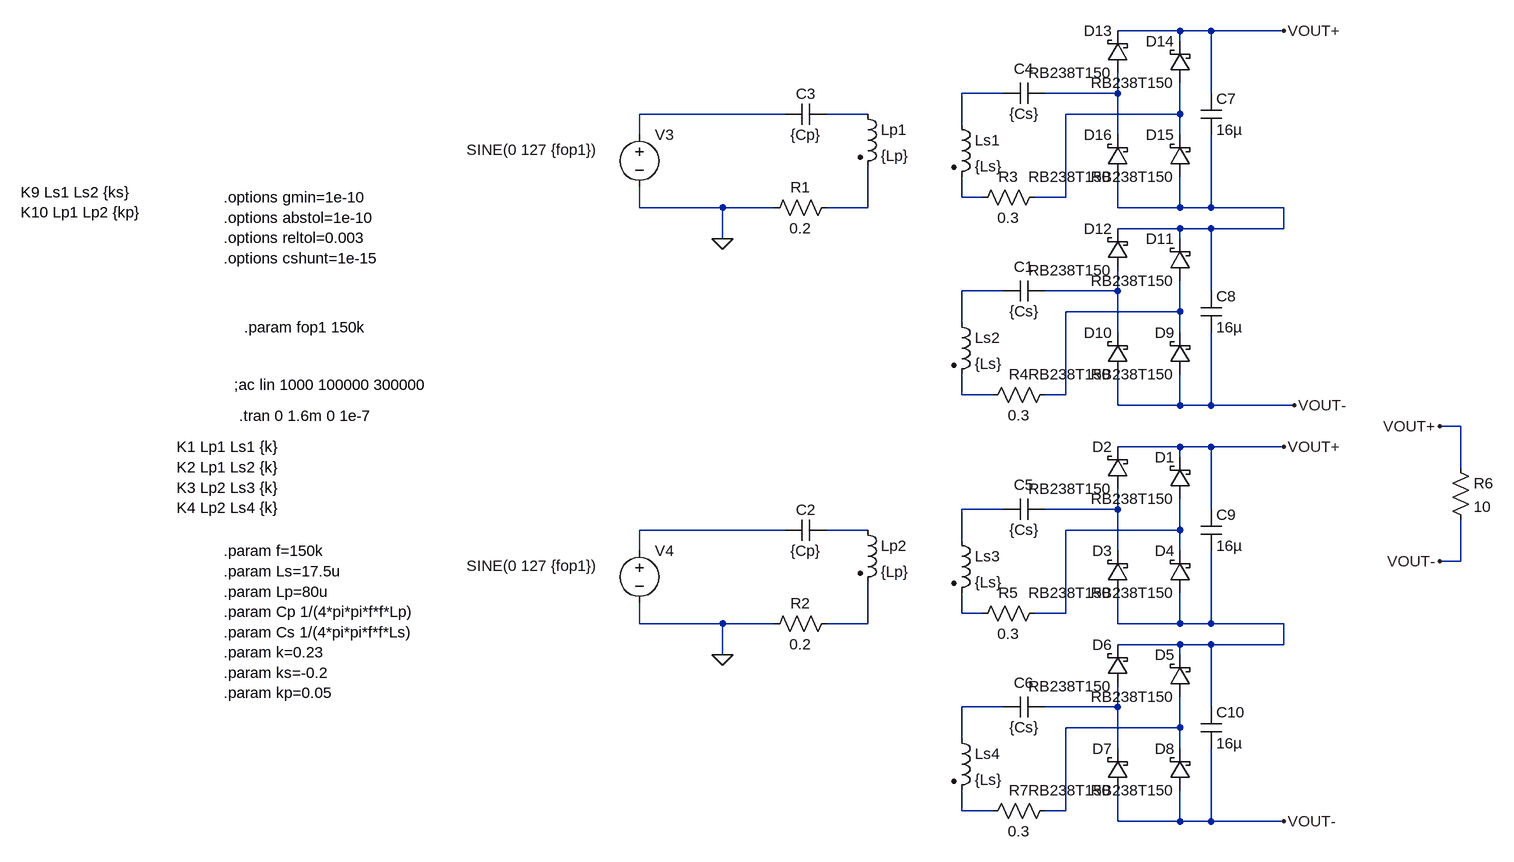
[diagram p0: schematic 2p-4s-series.asc]
2p-4s-series.asc, the LTspice schematic file:
Version 4
SHEET 1 3864 3572
WIRE 1680 512 1584 512
WIRE 1728 512 1680 512
WIRE 1840 512 1728 512
WIRE 1680 528 1680 512
WIRE 1408 608 1344 608
WIRE 1584 608 1584 576
WIRE 1584 608 1472 608
WIRE 1728 608 1728 512
WIRE 1072 640 848 640
WIRE 1200 640 1136 640
WIRE 1680 640 1680 592
WIRE 1680 640 1504 640
WIRE 1344 656 1344 608
WIRE 848 672 848 640
WIRE 1584 672 1584 608
WIRE 1680 672 1680 640
WIRE 1344 768 1344 736
WIRE 1376 768 1344 768
WIRE 1504 768 1504 640
WIRE 1504 768 1456 768
WIRE 848 784 848 752
WIRE 976 784 848 784
WIRE 1056 784 976 784
WIRE 1200 784 1200 720
WIRE 1200 784 1136 784
WIRE 1584 784 1584 736
WIRE 1680 784 1680 736
WIRE 1680 784 1584 784
WIRE 1728 784 1728 672
WIRE 1728 784 1680 784
WIRE 1840 784 1728 784
WIRE 1680 816 1584 816
WIRE 1728 816 1680 816
WIRE 1840 816 1840 784
WIRE 1840 816 1728 816
WIRE 976 832 976 784
WIRE 1680 832 1680 816
WIRE 1408 912 1344 912
WIRE 1584 912 1584 880
WIRE 1584 912 1472 912
WIRE 1728 912 1728 816
WIRE 1680 944 1680 896
WIRE 1680 944 1504 944
WIRE 1344 960 1344 912
WIRE 1584 976 1584 912
WIRE 1680 976 1680 944
WIRE 1344 1072 1344 1040
WIRE 1392 1072 1344 1072
WIRE 1504 1072 1504 944
WIRE 1504 1072 1472 1072
WIRE 1584 1088 1584 1040
WIRE 1680 1088 1680 1040
WIRE 1680 1088 1584 1088
WIRE 1728 1088 1728 976
WIRE 1728 1088 1680 1088
WIRE 1856 1088 1728 1088
WIRE 2112 1120 2080 1120
WIRE 1680 1152 1584 1152
WIRE 1728 1152 1680 1152
WIRE 1840 1152 1728 1152
WIRE 1680 1168 1680 1152
WIRE 2112 1184 2112 1120
WIRE 1408 1248 1344 1248
WIRE 1584 1248 1584 1216
WIRE 1584 1248 1472 1248
WIRE 1728 1248 1728 1152
WIRE 1072 1280 848 1280
WIRE 1200 1280 1136 1280
WIRE 1680 1280 1680 1232
WIRE 1680 1280 1504 1280
WIRE 1344 1296 1344 1248
WIRE 848 1312 848 1280
WIRE 1584 1312 1584 1248
WIRE 1680 1312 1680 1280
WIRE 2112 1328 2112 1264
WIRE 2112 1328 2080 1328
WIRE 1344 1408 1344 1376
WIRE 1376 1408 1344 1408
WIRE 1504 1408 1504 1280
WIRE 1504 1408 1456 1408
WIRE 848 1424 848 1392
WIRE 976 1424 848 1424
WIRE 1056 1424 976 1424
WIRE 1200 1424 1200 1360
WIRE 1200 1424 1136 1424
WIRE 1584 1424 1584 1376
WIRE 1680 1424 1680 1376
WIRE 1680 1424 1584 1424
WIRE 1728 1424 1728 1312
WIRE 1728 1424 1680 1424
WIRE 1840 1424 1728 1424
WIRE 1680 1456 1584 1456
WIRE 1728 1456 1680 1456
WIRE 1840 1456 1840 1424
WIRE 1840 1456 1728 1456
WIRE 976 1472 976 1424
WIRE 1680 1472 1680 1456
WIRE 1408 1552 1344 1552
WIRE 1584 1552 1584 1520
WIRE 1584 1552 1472 1552
WIRE 1728 1552 1728 1456
WIRE 1680 1584 1680 1536
WIRE 1680 1584 1504 1584
WIRE 1344 1600 1344 1552
WIRE 1584 1616 1584 1552
WIRE 1680 1616 1680 1584
WIRE 1344 1712 1344 1680
WIRE 1392 1712 1344 1712
WIRE 1504 1712 1504 1584
WIRE 1504 1712 1472 1712
WIRE 1584 1728 1584 1680
WIRE 1680 1728 1680 1680
WIRE 1680 1728 1584 1728
WIRE 1728 1728 1728 1616
WIRE 1728 1728 1680 1728
WIRE 1840 1728 1728 1728
FLAG 976 832 0
FLAG 2080 1120 VOUT+
FLAG 2080 1328 VOUT-
FLAG 976 1472 0
FLAG 1840 1728 VOUT-
FLAG 1840 512 VOUT+
FLAG 1840 1152 VOUT+
FLAG 1856 1088 VOUT-
SYMBOL ind2 1184 624 R0
SYMATTR InstName Lp1
SYMATTR Value {Lp}
SYMATTR Type ind
SYMBOL cap 1136 624 R90
WINDOW 0 0 32 VBottom 2
WINDOW 3 32 32 VTop 2
SYMATTR InstName C3
SYMATTR Value {Cp}
SYMBOL ind2 1328 640 R0
SYMATTR InstName Ls1
SYMATTR Value {Ls}
SYMATTR Type ind
SYMBOL cap 1472 592 R90
WINDOW 0 -6 32 VBottom 2
WINDOW 3 32 32 VTop 2
SYMATTR InstName C4
SYMATTR Value {Cs}
SYMBOL ind2 1328 944 R0
SYMATTR InstName Ls2
SYMATTR Value {Ls}
SYMATTR Type ind
SYMBOL cap 1472 896 R90
WINDOW 0 -6 32 VBottom 2
WINDOW 3 32 32 VTop 2
SYMATTR InstName C1
SYMATTR Value {Cs}
SYMBOL schottky 1600 1040 R180
WINDOW 0 24 64 Left 2
WINDOW 3 24 0 Left 2
SYMATTR InstName D10
SYMATTR Value RB238T150
SYMATTR Description Diode
SYMATTR Type diode
SYMBOL cap 1712 608 R0
SYMATTR InstName C7
SYMATTR Value 16µ
SYMBOL cap 1712 912 R0
SYMATTR InstName C8
SYMATTR Value 16µ
SYMBOL res 2096 1168 R0
SYMATTR InstName R6
SYMATTR Value 10
SYMBOL res 1152 768 R90
WINDOW 0 0 56 VBottom 2
WINDOW 3 32 56 VTop 2
SYMATTR InstName R1
SYMATTR Value 0.2
SYMBOL res 1472 752 R90
WINDOW 0 0 56 VBottom 2
WINDOW 3 32 56 VTop 2
SYMATTR InstName R3
SYMATTR Value 0.3
SYMBOL res 1488 1056 R90
WINDOW 0 0 56 VBottom 2
WINDOW 3 32 56 VTop 2
SYMATTR InstName R4
SYMATTR Value 0.3
SYMBOL voltage 848 656 R0
WINDOW 3 -266 39 Left 2
WINDOW 123 0 0 Left 0
WINDOW 39 0 0 Left 0
SYMATTR InstName V3
SYMATTR Value SINE(0 127 {fop1})
SYMBOL ind2 1184 1264 R0
SYMATTR InstName Lp2
SYMATTR Value {Lp}
SYMATTR Type ind
SYMBOL cap 1136 1264 R90
WINDOW 0 0 32 VBottom 2
WINDOW 3 32 32 VTop 2
SYMATTR InstName C2
SYMATTR Value {Cp}
SYMBOL ind2 1328 1280 R0
SYMATTR InstName Ls3
SYMATTR Value {Ls}
SYMATTR Type ind
SYMBOL cap 1472 1232 R90
WINDOW 0 -6 32 VBottom 2
WINDOW 3 32 32 VTop 2
SYMATTR InstName C5
SYMATTR Value {Cs}
SYMBOL ind2 1328 1584 R0
SYMATTR InstName Ls4
SYMATTR Value {Ls}
SYMATTR Type ind
SYMBOL cap 1472 1536 R90
WINDOW 0 -6 32 VBottom 2
WINDOW 3 32 32 VTop 2
SYMATTR InstName C6
SYMATTR Value {Cs}
SYMBOL cap 1712 1248 R0
SYMATTR InstName C9
SYMATTR Value 16µ
SYMBOL cap 1712 1552 R0
SYMATTR InstName C10
SYMATTR Value 16µ
SYMBOL res 1152 1408 R90
WINDOW 0 0 56 VBottom 2
WINDOW 3 32 56 VTop 2
SYMATTR InstName R2
SYMATTR Value 0.2
SYMBOL res 1472 1392 R90
WINDOW 0 0 56 VBottom 2
WINDOW 3 32 56 VTop 2
SYMATTR InstName R5
SYMATTR Value 0.3
SYMBOL res 1488 1696 R90
WINDOW 0 0 56 VBottom 2
WINDOW 3 32 56 VTop 2
SYMATTR InstName R7
SYMATTR Value 0.3
SYMBOL voltage 848 1296 R0
WINDOW 3 -266 39 Left 2
WINDOW 123 0 0 Left 0
WINDOW 39 0 0 Left 0
SYMATTR InstName V4
SYMATTR Value SINE(0 127 {fop1})
SYMBOL schottky 1696 1040 R180
WINDOW 0 24 64 Left 2
WINDOW 3 24 0 Left 2
SYMATTR InstName D9
SYMATTR Value RB238T150
SYMATTR Description Diode
SYMATTR Type diode
SYMBOL schottky 1696 896 R180
WINDOW 0 24 64 Left 2
WINDOW 3 24 0 Left 2
SYMATTR InstName D11
SYMATTR Value RB238T150
SYMATTR Description Diode
SYMATTR Type diode
SYMBOL schottky 1600 880 R180
WINDOW 0 24 64 Left 2
WINDOW 3 24 0 Left 2
SYMATTR InstName D12
SYMATTR Value RB238T150
SYMATTR Description Diode
SYMATTR Type diode
SYMBOL schottky 1696 1232 R180
WINDOW 0 24 64 Left 2
WINDOW 3 24 0 Left 2
SYMATTR InstName D1
SYMATTR Value RB238T150
SYMATTR Description Diode
SYMATTR Type diode
SYMBOL schottky 1600 1216 R180
WINDOW 0 24 64 Left 2
WINDOW 3 24 0 Left 2
SYMATTR InstName D2
SYMATTR Value RB238T150
SYMATTR Description Diode
SYMATTR Type diode
SYMBOL schottky 1600 1376 R180
WINDOW 0 24 64 Left 2
WINDOW 3 24 0 Left 2
SYMATTR InstName D3
SYMATTR Value RB238T150
SYMATTR Description Diode
SYMATTR Type diode
SYMBOL schottky 1696 1376 R180
WINDOW 0 24 64 Left 2
WINDOW 3 24 0 Left 2
SYMATTR InstName D4
SYMATTR Value RB238T150
SYMATTR Description Diode
SYMATTR Type diode
SYMBOL schottky 1696 1536 R180
WINDOW 0 24 64 Left 2
WINDOW 3 24 0 Left 2
SYMATTR InstName D5
SYMATTR Value RB238T150
SYMATTR Description Diode
SYMATTR Type diode
SYMBOL schottky 1600 1520 R180
WINDOW 0 24 64 Left 2
WINDOW 3 24 0 Left 2
SYMATTR InstName D6
SYMATTR Value RB238T150
SYMATTR Description Diode
SYMATTR Type diode
SYMBOL schottky 1600 1680 R180
WINDOW 0 24 64 Left 2
WINDOW 3 24 0 Left 2
SYMATTR InstName D7
SYMATTR Value RB238T150
SYMATTR Description Diode
SYMATTR Type diode
SYMBOL schottky 1696 1680 R180
WINDOW 0 24 64 Left 2
WINDOW 3 24 0 Left 2
SYMATTR InstName D8
SYMATTR Value RB238T150
SYMATTR Description Diode
SYMATTR Type diode
SYMBOL schottky 1600 576 R180
WINDOW 0 24 64 Left 2
WINDOW 3 24 0 Left 2
SYMATTR InstName D13
SYMATTR Value RB238T150
SYMATTR Description Diode
SYMATTR Type diode
SYMBOL schottky 1696 592 R180
WINDOW 0 24 64 Left 2
WINDOW 3 24 0 Left 2
SYMATTR InstName D14
SYMATTR Value RB238T150
SYMATTR Description Diode
SYMATTR Type diode
SYMBOL schottky 1696 736 R180
WINDOW 0 24 64 Left 2
WINDOW 3 24 0 Left 2
SYMATTR InstName D15
SYMATTR Value RB238T150
SYMATTR Description Diode
SYMATTR Type diode
SYMBOL schottky 1600 736 R180
WINDOW 0 24 64 Left 2
WINDOW 3 24 0 Left 2
SYMATTR InstName D16
SYMATTR Value RB238T150
SYMATTR Description Diode
SYMATTR Type diode
TEXT 232 1104 Left 2 !.tran 0 1.6m 0 1e-7
TEXT 208 1312 Left 2 !.param f=150k\n.param Ls=17.5u\n.param Lp=80u\n.param Cp 1/(4*pi*pi*f*f*Lp)\n.param Cs 1/(4*pi*pi*f*f*Ls)\n.param k=0.23\n.param ks=-0.2\n.param kp=0.05
TEXT 224 1056 Left 2 !;ac lin 1000 100000 300000
TEXT 240 968 Left 2 !.param fop1 150k
TEXT 136 1152 Left 2 !K1 Lp1 Ls1 {k}\nK2 Lp1 Ls2 {k}\nK3 Lp2 Ls3 {k}\nK4 Lp2 Ls4 {k}
TEXT 208 768 Left 2 !.options gmin=1e-10   \n.options abstol=1e-10  \n.options reltol=0.003  \n.options cshunt=1e-15
TEXT -104 760 Left 2 !K9 Ls1 Ls2 {ks}\nK10 Lp1 Lp2 {kp}

The netlist it stands for:
* 2p-4s-series.asc
Lp1 N004 N007 {Lp}
C3 N004 N003 {Cp}
Ls1 N001 N006 {Ls}
C4 N002 N001 {Cs}
Ls2 N009 N012 {Ls}
C1 N010 N009 {Cs}
D10 VOUT- N010 RB238T150
C7 VOUT+ N008 16µ
C8 N008 VOUT- 16µ
R6 VOUT+ VOUT- 10
R1 N007 0 0.2
R3 N005 N006 0.3
R4 N011 N012 0.3
V3 N003 0 SINE(0 127 {fop1})
Lp2 N016 N019 {Lp}
C2 N016 N015 {Cp}
Ls3 N013 N018 {Ls}
C5 N014 N013 {Cs}
Ls4 N021 N024 {Ls}
C6 N022 N021 {Cs}
C9 VOUT+ N020 16µ
C10 N020 VOUT- 16µ
R2 N019 0 0.2
R5 N017 N018 0.3
R7 N023 N024 0.3
V4 N015 0 SINE(0 127 {fop1})
D9 VOUT- N011 RB238T150
D11 N011 N008 RB238T150
D12 N010 N008 RB238T150
D1 N017 VOUT+ RB238T150
D2 N014 VOUT+ RB238T150
D3 N020 N014 RB238T150
D4 N020 N017 RB238T150
D5 N023 N020 RB238T150
D6 N022 N020 RB238T150
D7 VOUT- N022 RB238T150
D8 VOUT- N023 RB238T150
D13 N002 VOUT+ RB238T150
D14 N005 VOUT+ RB238T150
D15 N008 N005 RB238T150
D16 N008 N002 RB238T150
.model D D
.lib standard.dio
.tran 0 1.6m 0 1e-7
.param f=150k
.param Ls=17.5u
.param Lp=80u
.param Cp 1/(4*pi*pi*f*f*Lp)
.param Cs 1/(4*pi*pi*f*f*Ls)
.param k=0.23
.param ks=-0.2
.param kp=0.05
;ac lin 1000 100000 300000
.param fop1 150k
K1 Lp1 Ls1 {k}
K2 Lp1 Ls2 {k}
K3 Lp2 Ls3 {k}
K4 Lp2 Ls4 {k}
.options gmin=1e-10
.options abstol=1e-10
.options reltol=0.003
.options cshunt=1e-15
K9 Ls1 Ls2 {ks}
K10 Lp1 Lp2 {kp}
.backanno
.end